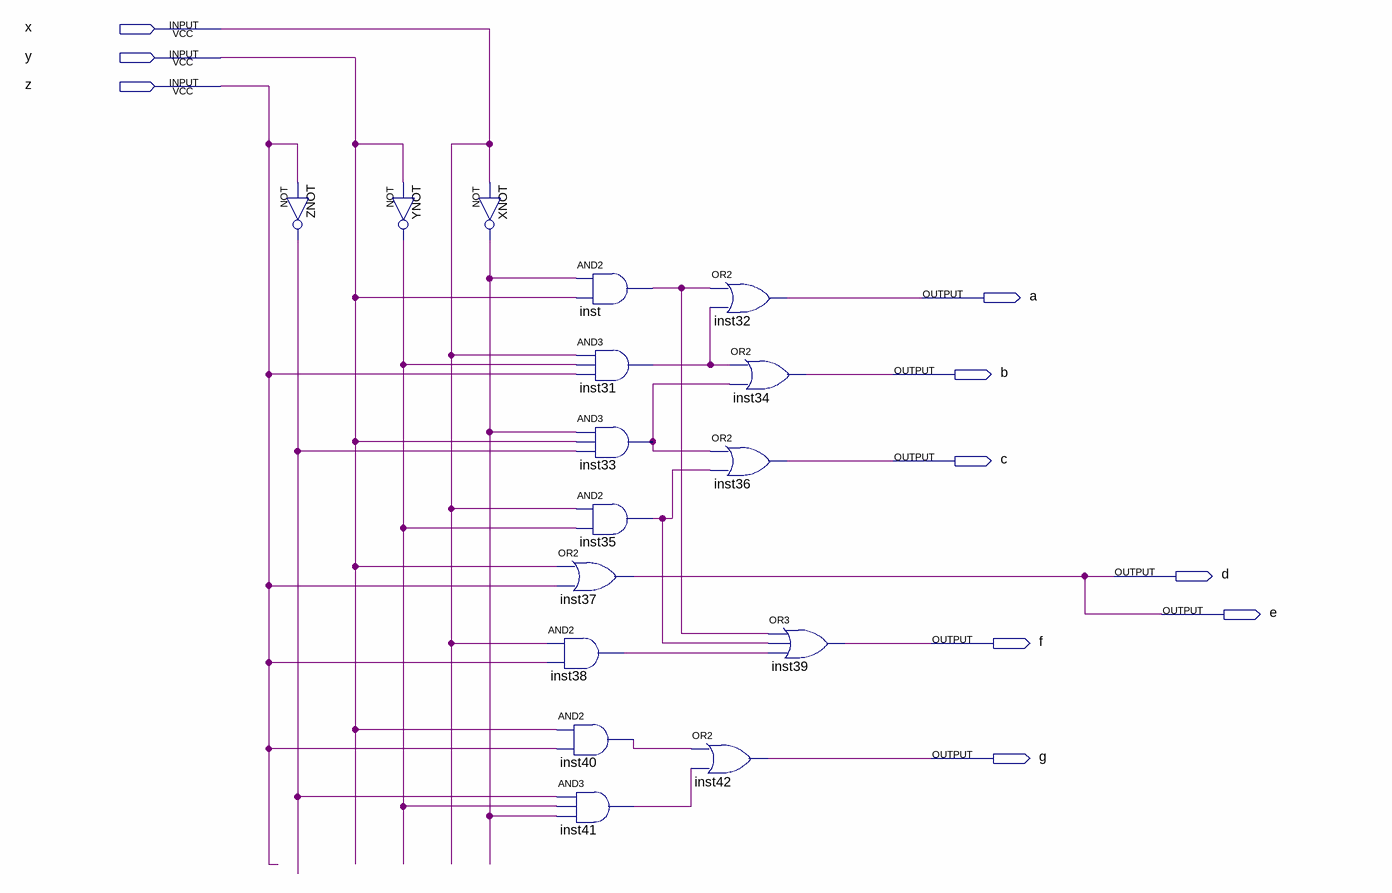
[diagram p0: schematic sheet]
// Quartus schematic DOB_SSD.bdf as structural Verilog: 16 symbols, 10 pins
module DOB_SSD (
  input  x,
  input  y,
  input  z,
  output a,
  output b,
  output c,
  output d,
  output e,
  output f,
  output g
);

  wire inst31_out, inst33_out, inst35_out, inst38_out, inst40_out, inst41_out, inst_out, XNOT_out, YNOT_out,
       ZNOT_out;

  not ZNOT (ZNOT_out, z);
  not YNOT (YNOT_out, y);
  not XNOT (XNOT_out, x);
  and inst (inst_out, XNOT_out, y);
  and inst31 (inst31_out, x, YNOT_out, z);
  and inst33 (inst33_out, XNOT_out, y, ZNOT_out);
  and inst35 (inst35_out, x, YNOT_out);
  or inst37 (d, y, z);
  and inst38 (inst38_out, x, z);
  and inst40 (inst40_out, y, z);
  and inst41 (inst41_out, ZNOT_out, YNOT_out, XNOT_out);
  or inst32 (a, inst_out, inst31_out);
  or inst34 (b, inst31_out, inst33_out);
  or inst36 (c, inst33_out, inst35_out);
  or inst42 (g, inst40_out, inst41_out);
  or inst39 (f, inst_out, inst35_out, inst38_out);

  assign e = d;
endmodule
